# Altium schematic sheet 5_POWER.SchDoc
size A4
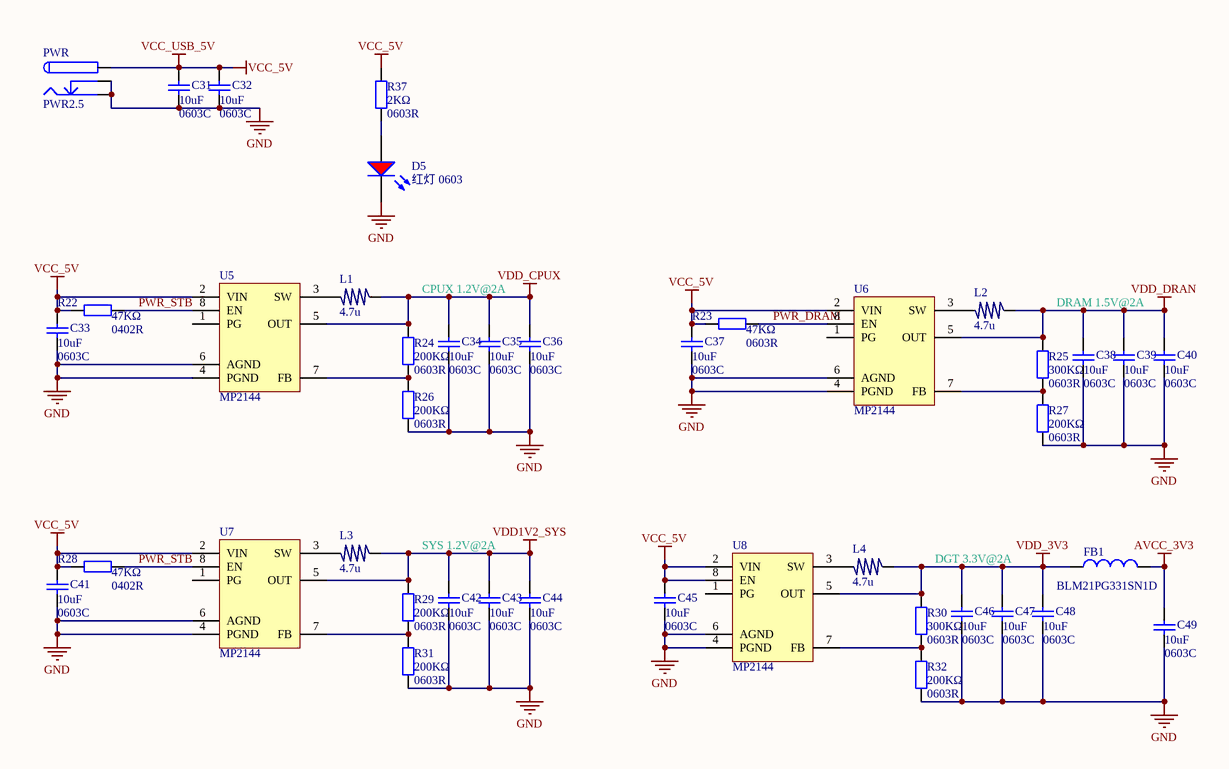
[diagram p0: 5_POWER.SchDoc]

## Parts
C31  10uF  Package: 0603C  [0603_C]
C32  10uF  Package: 0603C  [0603_C]
C33  10uF  Package: 0603C  [0603_C]
C34  10uF  Package: 0603C  [0603_C]
C35  10uF  Package: 0603C  [0603_C]
C36  10uF  Package: 0603C  [0603_C]
C37  10uF  Package: 0603C  [0603_C]
C38  10uF  Package: 0603C  [0603_C]
C39  10uF  Package: 0603C  [0603_C]
C40  10uF  Package: 0603C  [0603_C]
C41  10uF  Package: 0603C  [0603_C]
C42  10uF  Package: 0603C  [0603_C]
C43  10uF  Package: 0603C  [0603_C]
C44  10uF  Package: 0603C  [0603_C]
C45  10uF  Package: 0603C  [0603_C]
C46  10uF  Package: 0603C  [0603_C]
C47  10uF  Package: 0603C  [0603_C]
C48  10uF  Package: 0603C  [0603_C]
C49  10uF  Package: 0603C  [0603_C]
D5  红灯 0603  [0603_LED_S1]
FB1  BLM21PG331SN1D  [F0805]
L1  value 4.7u  [CD43NP]  (hidden comment: 4R7_CD43)
L2  value 4.7u  [CD43NP]  (hidden comment: 4R7_CD43)
L3  value 4.7u  [CD43NP]  (hidden comment: 4R7_CD43)
L4  value 4.7u  [CD43NP]  (hidden comment: 4R7_CD43)
PWR  PWR2.5  [DC-PJ044A]
R22  47KΩ  Package: 0402R  [0402_R]
R23  47KΩ  Package: 0603R  [0603_R]
R24  200KΩ  Package: 0603R  [0603_R]
R25  300KΩ  Package: 0603R  [0603_R]
R26  200KΩ  Package: 0603R  [0603_R]
R27  200KΩ  Package: 0603R  [0603_R]
R28  47KΩ  Package: 0402R  [0402_R]
R29  200KΩ  Package: 0603R  [0603_R]
R30  300KΩ  Package: 0603R  [0603_R]
R31  200KΩ  Package: 0603R  [0603_R]
R32  200KΩ  Package: 0603R  [0603_R]
R37  2KΩ  Package: 0603R  [0603_R]
U5  MP2144  [SOT23-8]
U6  MP2144  [SOT23-8]
U7  MP2144  [SOT23-8]
U8  MP2144  [SOT23-8]

## Nets
AVCC_3V3: C49.2 FB1.2
GND: C31.1 C32.1 C33.1 C34.1 C35.1 C36.1 C37.1 C38.1 C39.1 C40.1 C41.1 C42.1 C43.1 C44.1 C45.1 C46.1 C47.1 C48.1 C49.1 D5.K PWR.2 PWR.3 R26.2 R27.2 R31.2 R32.2 U5.4(PGND) U5.6(AGND) U6.4(PGND) U6.6(AGND) U7.4(PGND) U7.6(AGND) U8.4(PGND) U8.6(AGND)
VCC_5V: C31.2 C32.2 C33.2 C37.2 C41.2 C45.2 PWR.1 R22.1 R23.1 R28.1 R37.1 U5.2(VIN) U6.2(VIN) U7.2(VIN) U8.2(VIN) U8.8(EN)  [also labelled VCC_USB_5V]
VDD1V2_SYS: C42.2 C43.2 C44.2 L3.1 R29.1 U7.5(OUT)
VDD_3V3: C46.2 C47.2 C48.2 FB1.1 L4.1 R30.1 U8.5(OUT)
VDD_CPUX: C34.2 C35.2 C36.2 L1.1 R24.1 U5.5(OUT)
VDD_DRAN: C38.2 C39.2 C40.2 L2.1 R25.1 U6.5(OUT)
PWR_DRAM: R23.2 U6.8(EN)
PWR_STB: R22.2 R28.2 U5.8(EN) U7.8(EN)
NetD5_A: D5.A R37.2
NetL1_2: L1.2 U5.3(SW)
NetL2_2: L2.2 U6.3(SW)
NetL3_2: L3.2 U7.3(SW)
NetL4_2: L4.2 U8.3(SW)
NetR24_2: R24.2 R26.1 U5.7(FB)
NetR25_2: R25.2 R27.1 U6.7(FB)
NetR29_2: R29.2 R31.1 U7.7(FB)
NetR30_2: R30.2 R32.1 U8.7(FB)

Not connected (* = marked no-connect by the designer): U5 1(PG); U6 1(PG); U7 1(PG); U8 1(PG)

## Notes on the sheet
- CPUX 1.2V@2A
- DRAM 1.5V@2A
- SYS 1.2V@2A
- DGT 3.3V@2A

## Library data of the parts
C31-C49 = 0603 1uF (105) 10% 50V: 贴片电容; ComponentLink1Description: 供应商链接; ComponentLink1URL: http://www.szlcsc.com/product/details_16531.html; Supplier: LC; SuppliersPartNumber: C15849
D5 = 0603 红灯: 发光二极管; ComponentLink1Description: 供应商链接; ComponentLink1URL: http://www.szlcsc.com/product/details_2659.html; Package: 0603; Supplier: LC; SuppliersPartNumber: C2286
FB1 = FB: 磁珠
L1-L4 = L
PWR = PWR2.5: Low Voltage Power Supply Connector; Published: 17-Dec-2003; DatasheetDocument: 09-May-2002; Publisher: Altium Limited; ComponentLink1Description: Manufacturer Link; ComponentLink1URL: http://domino.kycon.com/internet/Products.html
R22-R32 R37 = 0402 1KΩ (1001) 1%: 贴片电阻; ComponentLink1Description: 供应商链接; ComponentLink1URL: http://www.szlcsc.com/product/details_12256.html; Supplier: LC; SuppliersPartNumber: C11702